# Altium project libs.PrjPcb
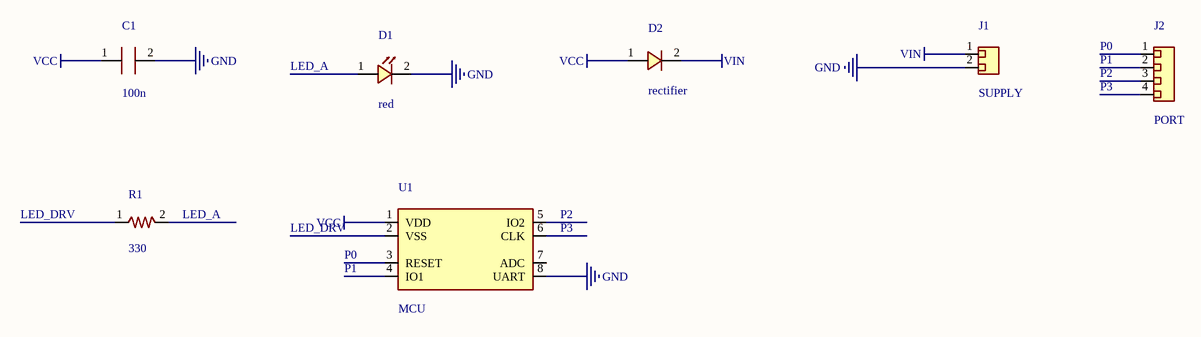
[diagram p0: libs.SchDoc]
1 sheet, 7 parts. Net scope: global (net labels, ports and power ports of the same name join across sheets).
Board file: libs.PcbDoc

## Sheet libs.SchDoc
size A4

### Parts
C1  100n  [Chip_0805]
D1  red  [LED0603_Kingbright_APT1608SURCK]
D2  rectifier  [DO214AC]
J1  SUPPLY  [Header_1x2_P2.54]
J2  PORT  [Header_1x4_P2.54]
R1  330  [Chip_0603]
U1  MCU  [DIP8_Microchip_P]

### Nets
GND: C1.2(B) D1.2(K) J1.2(Passive) U1.8(UART)
VCC: C1.1(A) D2.1(A) U1.1(VDD)
VIN: D2.2(K) J1.1(Passive)
LED_A: D1.1(A) R1.2(B)
LED_DRV: R1.1(A) U1.2(VSS)
P0: J2.1(Passive) U1.3(RESET)
P1: J2.2(Passive) U1.4(IO1)
P2: J2.3(Passive) U1.5(IO2)
P3: J2.4(Passive) U1.6(CLK)

Not connected (* = marked no-connect by the designer): U1 7(ADC)

### Library data of the parts
C1 = Capacitor
D1 = LED: pin to pad: 1>2 2>1
D2 = Diode
J1 = Connector_2
J2 = Connector_4
R1 = Resistor
U1 = Microcontroller